# Altium project HenHouseController.PrjPCB
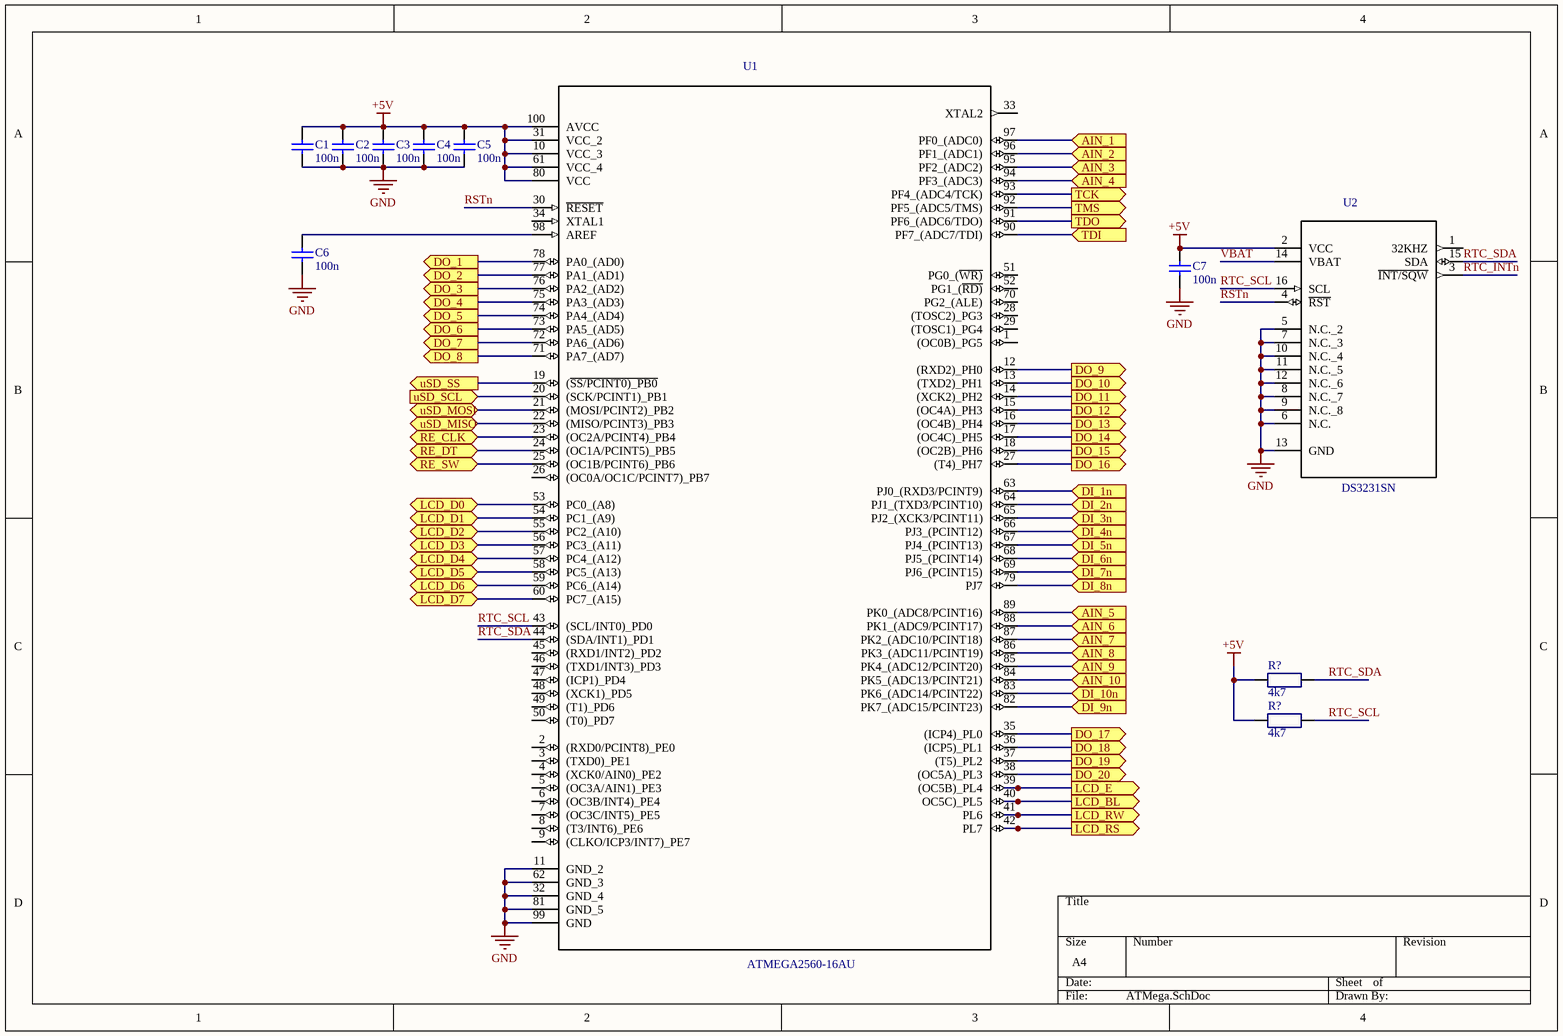
[diagram p0: ATMega.SchDoc]
3 sheets, 41 parts. Net scope: flat (ports and power ports of the same name join across sheets).
Board file: HenHouseController.PcbDoc
Sheets:
  HenHouseController.SchDoc
  ATMega.SchDoc
  InputOutput.SchDoc

## Sheet HenHouseController.SchDoc
size A4

## Sheet ATMega.SchDoc
size A4

### Parts
(Parts that share a designator on the sheet are numbered #1, #2 ... from top to bottom, then left to right.)
C1  value 100n  [CAP_0402]  (hidden comment: 0402)
C2  value 100n  [CAP_0402]  (hidden comment: 0402)
C3  value 100n  [CAP_0402]  (hidden comment: 0402)
C4  value 100n  [CAP_0402]  (hidden comment: 0402)
C5  value 100n  [CAP_0402]  (hidden comment: 0402)
C6  value 100n  [CAP_0402]  (hidden comment: 0402)
C7  value 100n  [CAP_0402]  (hidden comment: 0402)
R?#1  value 4k7  [RES_0402]  (hidden comment: RES_0402)
R?#2  value 4k7  [RES_0402]  (hidden comment: RES_0402)
U1  ATMEGA2560-16AU  [QFP50P1600X1600X120-100N]
U2  DS3231SN  [SOIC127P1032X265-16N]

### Ports
AIN_1 (in), AIN_2 (in), AIN_3 (in), AIN_4 (in), AIN_5 (in), AIN_6 (in), AIN_7 (in), AIN_8 (in), AIN_9 (in), AIN_10 (in), DI_1n (in), DI_2n (in), DI_3n (in), DI_4n (in), DI_5n (in), DI_6n (in), DI_7n (in), DI_8n (in), DI_9n (in), DI_10n (in), DO_1 (out), DO_2 (out), DO_3 (out), DO_4 (out), DO_5 (out), DO_6 (out), DO_7 (out), DO_8 (out), DO_9 (out), DO_10 (out), DO_11 (out), DO_12 (out), DO_13 (out), DO_14 (out), DO_15 (out), DO_16 (out), DO_17 (out), DO_18 (out), DO_19 (out), DO_20 (out), LCD_BL (out), LCD_D0 (bidir), LCD_D1 (bidir), LCD_D2 (bidir), LCD_D3 (bidir), LCD_D4 (bidir), LCD_D5 (bidir), LCD_D6 (bidir), LCD_D7 (bidir), LCD_E (out), LCD_RS (out), LCD_RW (out), RE_CLK (bidir), RE_DT (bidir), RE_SW (bidir), TCK (out), TDI (in), TDO (out), TMS (out), uSD_MISO (bidir), uSD_MOSI (bidir), uSD_SCL (in), uSD_SS (out)

### Nets
+5V: C1.2 C2.2 C3.2 C4.2 C5.2 C7.2 R?#1.1 R?#2.1 U1.10(VCC_3) U1.31(VCC_2) U1.61(VCC_4) U1.80(VCC) U1.100(AVCC) U2.2(VCC)
GND: C1.1 C2.1 C3.1 C4.1 C5.1 C6.1 C7.1 U1.11(GND_2) U1.32(GND_4) U1.62(GND_3) U1.81(GND_5) U1.99(GND) U2.5(N.C._2) U2.6(N.C.) U2.7(N.C._3) U2.8(N.C._7) U2.9(N.C._8) U2.10(N.C._4) U2.11(N.C._5) U2.12(N.C._6) U2.13(GND)
LCD_DB0: U1.53(PC0_(A8)) ; port LCD_D0
LCD_DB1: U1.54(PC1_(A9)) ; port LCD_D1
LCD_DB2: U1.55(PC2_(A10)) ; port LCD_D2
LCD_DB3: U1.56(PC3_(A11)) ; port LCD_D3
LCD_DB4: U1.57(PC4_(A12)) ; port LCD_D4
LCD_DB5: U1.58(PC5_(A13)) ; port LCD_D5
LCD_DB6: U1.59(PC6_(A14)) ; port LCD_D6
LCD_DB7: U1.60(PC7_(A15)) ; port LCD_D7
LCD_E: U1.39((OC5B)_PL4) ; port LCD_E
LCD_RS: U1.42(PL7) ; port LCD_RS
LCD_RW: U1.41(PL6) ; port LCD_RW
RSTn: U1.30(~{RESET}) U2.4(~{RST})
RTC_INTn: U2.3(~{INT/SQW})
RTC_SCL: R?#2.2 U1.43((SCL/INT0)_PD0) U2.16(SCL)
RTC_SDA: R?#1.2 U1.44((SDA/INT1)_PD1) U2.15(SDA)
VBAT: U2.14(VBAT)
NetC6_2: C6.2 U1.98(AREF)
NetOC1_10: U1.66(PJ3_(PCINT12)) ; port DI_4n
NetOC1_12: U1.65(PJ2_(XCK3/PCINT11)) ; port DI_3n
NetOC1_14: U1.64(PJ1_(TXD3/PCINT10)) ; port DI_2n
NetOC1_16: U1.63(PJ0_(RXD3/PCINT9)) ; port DI_1n
NetOC2_14: U1.83(PK6_(ADC14/PCINT22)) ; port DI_10n
NetOC2_16: U1.82(PK7_(ADC15/PCINT23)) ; port DI_9n
NetOC3_10: U1.79(PJ7) ; port DI_8n
NetOC3_12: U1.69(PJ6_(PCINT15)) ; port DI_7n
NetOC3_14: U1.68(PJ5_(PCINT14)) ; port DI_6n
NetOC3_16: U1.67(PJ4_(PCINT13)) ; port DI_5n
NetR?#4_2: U1.40(OC5C)_PL5) ; port LCD_BL
NetU1_12: U1.12((RXD2)_PH0) ; port DO_9
NetU1_13: U1.13((TXD2)_PH1) ; port DO_10
NetU1_14: U1.14((XCK2)_PH2) ; port DO_11
NetU1_15: U1.15((OC4A)_PH3) ; port DO_12
NetU1_16: U1.16((OC4B)_PH4) ; port DO_13
NetU1_17: U1.17((OC4C)_PH5) ; port DO_14
NetU1_18: U1.18((OC2B)_PH6) ; port DO_15
NetU1_19: U1.19((~{SS/PCINT0)_PB0}) ; port uSD_SS
NetU1_20: U1.20((SCK/PCINT1)_PB1) ; port uSD_SCL
NetU1_21: U1.21((MOSI/PCINT2)_PB2) ; port uSD_MOSI
NetU1_22: U1.22((MISO/PCINT3)_PB3) ; port uSD_MISO
NetU1_23: U1.23((OC2A/PCINT4)_PB4) ; port RE_CLK
NetU1_24: U1.24((OC1A/PCINT5)_PB5) ; port RE_DT
NetU1_25: U1.25((OC1B/PCINT6)_PB6) ; port RE_SW
NetU1_27: U1.27((T4)_PH7) ; port DO_16
NetU1_35: U1.35((ICP4)_PL0) ; port DO_17
NetU1_36: U1.36((ICP5)_PL1) ; port DO_18
NetU1_37: U1.37((T5)_PL2) ; port DO_19
NetU1_38: U1.38((OC5A)_PL3) ; port DO_20
NetU1_71: U1.71(PA7_(AD7)) ; port DO_8
NetU1_72: U1.72(PA6_(AD6)) ; port DO_7
NetU1_73: U1.73(PA5_(AD5)) ; port DO_6
NetU1_74: U1.74(PA4_(AD4)) ; port DO_5
NetU1_75: U1.75(PA3_(AD3)) ; port DO_4
NetU1_76: U1.76(PA2_(AD2)) ; port DO_3
NetU1_77: U1.77(PA1_(AD1)) ; port DO_2
NetU1_78: U1.78(PA0_(AD0)) ; port DO_1
NetU1_84: U1.84(PK5_(ADC13/PCINT21)) ; port AIN_10
NetU1_85: U1.85(PK4_(ADC12/PCINT20)) ; port AIN_9
NetU1_86: U1.86(PK3_(ADC11/PCINT19)) ; port AIN_8
NetU1_87: U1.87(PK2_(ADC10/PCINT18)) ; port AIN_7
NetU1_88: U1.88(PK1_(ADC9/PCINT17)) ; port AIN_6
NetU1_89: U1.89(PK0_(ADC8/PCINT16)) ; port AIN_5
NetU1_90: U1.90(PF7_(ADC7/TDI)) ; port TDI
NetU1_91: U1.91(PF6_(ADC6/TDO)) ; port TDO
NetU1_92: U1.92(PF5_(ADC5/TMS)) ; port TMS
NetU1_93: U1.93(PF4_(ADC4/TCK)) ; port TCK
NetU1_94: U1.94(PF3_(ADC3)) ; port AIN_4
NetU1_95: U1.95(PF2_(ADC2)) ; port AIN_3
NetU1_96: U1.96(PF1_(ADC1)) ; port AIN_2
NetU1_97: U1.97(PF0_(ADC0)) ; port AIN_1

Not connected (* = marked no-connect by the designer): U1 1((OC0B)_PG5) 2((RXD0/PCINT8)_PE0) 3((TXD0)_PE1) 4((XCK0/AIN0)_PE2) 5((OC3A/AIN1)_PE3) 6((OC3B/INT4)_PE4) 7((OC3C/INT5)_PE5) 8((T3/INT6)_PE6) 9((CLKO/ICP3/INT7)_PE7) 26((OC0A/OC1C/PCINT7)_PB7) 28((TOSC2)_PG3) 29((TOSC1)_PG4) 33(XTAL2) 34(XTAL1) 45((RXD1/INT2)_PD2) 46((TXD1/INT3)_PD3) 47((ICP1)_PD4) 48((XCK1)_PD5) 49((T1)_PD6) 50((T0)_PD7) 51(PG0_(~{WR)}) 52(PG1_(~{RD)}) 70(PG2_(ALE)); U2 1(32KHZ)

### Library data of the parts
C1-C7 = CAP_0402: Ceramic chip capacitor; SIGN: HL; Package: 0402; PartDescription: Chip capacitor; Component Class: A; Tolerance: ?
R?#1 R?#2 = RES_0402: SMD Chip Resistor 0402; SIGN: HL; PartDescription: Chip resistor; Package: 0402; Component Class: A; Operating Temperature: *; Tolerance: *
U1 = ATMEGA2560-16AU: Embedded microcontroller ATMEGA2560-16AU TQFP 100 _14x14_ Microchip Technology 8-Bit 16 MHz I/O number 86; SnapEDA_Link: https://www.snapeda.com/parts/ATMEGA2560-16AU/Microchip/view-part/?ref=snap; MF: Microchip; Price: None; Availability: Unavailable; MP: ATMEGA2560-16AU; Package: TQFP-100 Microchip; Value: *
U2 = DS3231SN: Real Time Clock Serial 16-Pin SOIC W; MF: Maxim Integrated; MP: DS3231SN#; Package: SOIC-16 Maxim Integrated; Price: None; SnapEDA_Link: https://www.snapeda.com/parts/DS3231SN%23/Maxim%20Integrated/view-part/?ref=snap; Availability: Unavailable; Value: *

## Sheet InputOutput.SchDoc
size A4
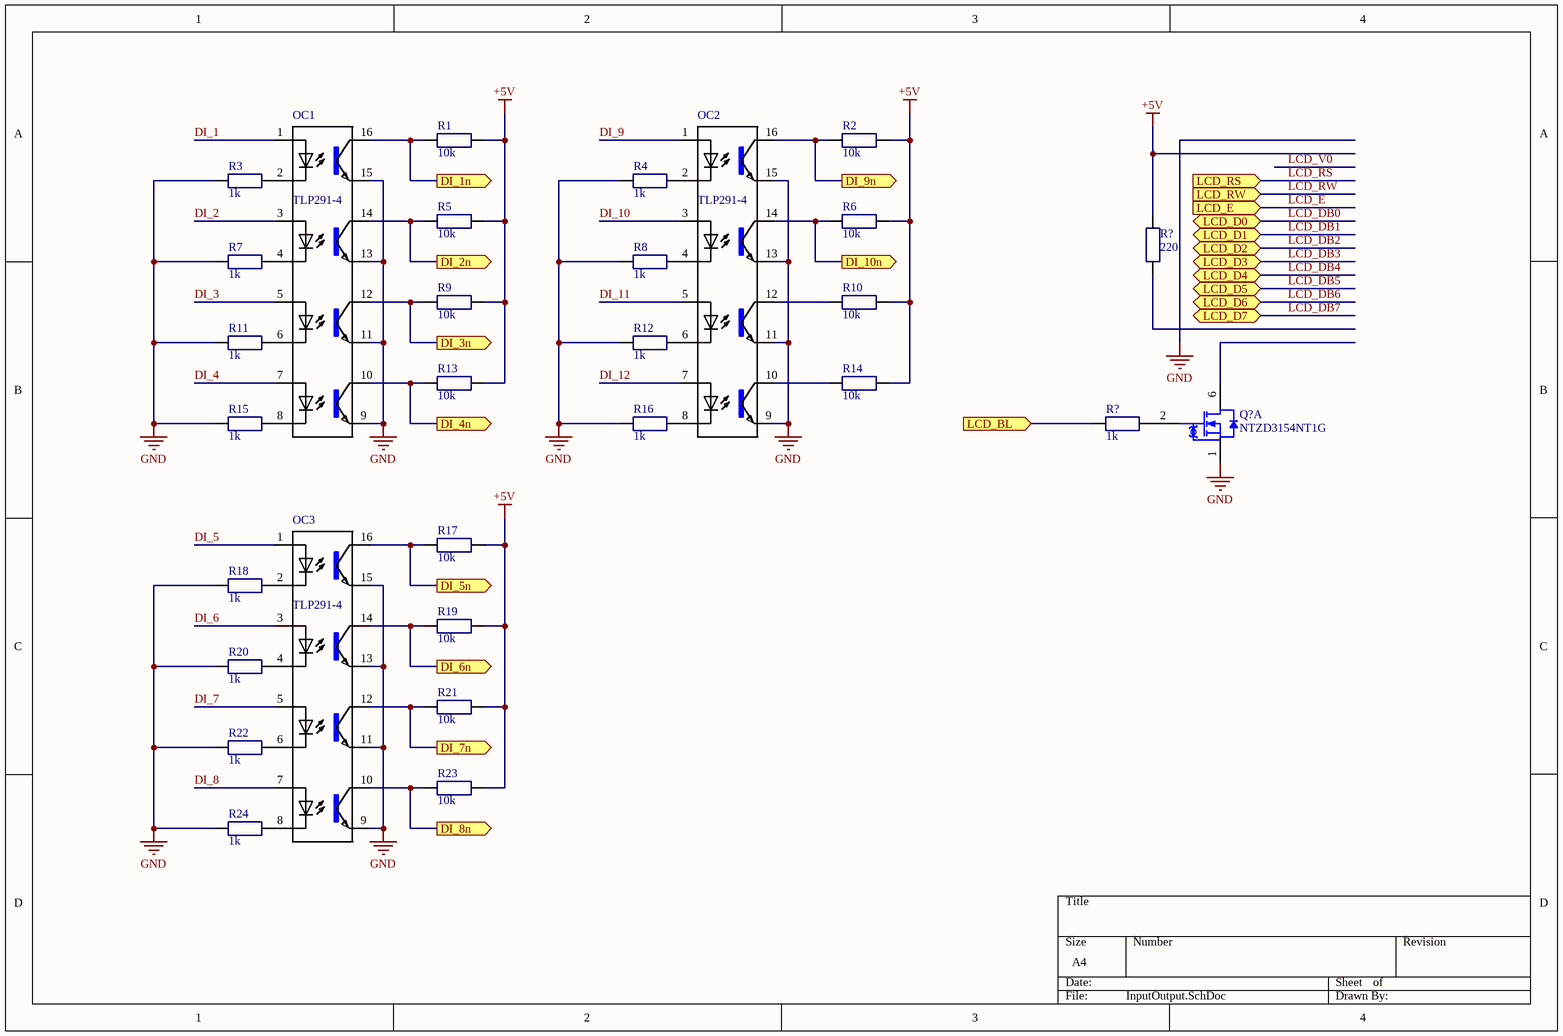
[diagram p1: InputOutput.SchDoc]

### Parts
(Parts that share a designator on the sheet are numbered #1, #2 ... from top to bottom, then left to right.)
OC1  TLP291-4
OC2  TLP291-4
OC3  TLP291-4
Q?  NTZD3154NT1G  [SOT-563-6-NTZD3154NT1G]  (part A of 2)
R1  value 10k  [RES_0402]  (hidden comment: RES_0402)
R2  value 10k  [RES_0402]  (hidden comment: RES_0402)
R3  value 1k  [RES_0402]  (hidden comment: RES_0402)
R4  value 1k  [RES_0402]  (hidden comment: RES_0402)
R5  value 10k  [RES_0402]  (hidden comment: RES_0402)
R6  value 10k  [RES_0402]  (hidden comment: RES_0402)
R7  value 1k  [RES_0402]  (hidden comment: RES_0402)
R8  value 1k  [RES_0402]  (hidden comment: RES_0402)
R9  value 10k  [RES_0402]  (hidden comment: RES_0402)
R10  value 10k  [RES_0402]  (hidden comment: RES_0402)
R11  value 1k  [RES_0402]  (hidden comment: RES_0402)
R12  value 1k  [RES_0402]  (hidden comment: RES_0402)
R13  value 10k  [RES_0402]  (hidden comment: RES_0402)
R14  value 10k  [RES_0402]  (hidden comment: RES_0402)
R15  value 1k  [RES_0402]  (hidden comment: RES_0402)
R16  value 1k  [RES_0402]  (hidden comment: RES_0402)
R17  value 10k  [RES_0402]  (hidden comment: RES_0402)
R18  value 1k  [RES_0402]  (hidden comment: RES_0402)
R19  value 10k  [RES_0402]  (hidden comment: RES_0402)
R20  value 1k  [RES_0402]  (hidden comment: RES_0402)
R21  value 10k  [RES_0402]  (hidden comment: RES_0402)
R22  value 1k  [RES_0402]  (hidden comment: RES_0402)
R23  value 10k  [RES_0402]  (hidden comment: RES_0402)
R24  value 1k  [RES_0402]  (hidden comment: RES_0402)
R?#3  value 220  [RES_0402]  (hidden comment: RES_0402)
R?#4  value 1k  [RES_0402]  (hidden comment: RES_0402)

### Ports
DI_1n (out), DI_2n (out), DI_3n (out), DI_4n (out), DI_5n (out), DI_6n (out), DI_7n (out), DI_8n (out), DI_9n (out), DI_10n (out), LCD_BL (in), LCD_D0 (bidir), LCD_D1 (bidir), LCD_D2 (bidir), LCD_D3 (bidir), LCD_D4 (bidir), LCD_D5 (bidir), LCD_D6 (bidir), LCD_D7 (bidir), LCD_E (in), LCD_RS (in), LCD_RW (in)

### Nets
+5V: R1.2 R2.2 R5.2 R6.2 R9.2 R10.2 R13.2 R14.2 R17.2 R19.2 R21.2 R23.2 R?#3.2
GND: OC1.9(EMI) OC1.11(EMI) OC1.13(EMI) OC1.15(EMI) OC2.9(EMI) OC2.11(EMI) OC2.13(EMI) OC2.15(EMI) OC3.9(EMI) OC3.11(EMI) OC3.13(EMI) OC3.15(EMI) Q?.1(S1) R3.1 R4.1 R7.1 R8.1 R11.1 R12.1 R15.1 R16.1 R18.1 R20.1 R22.1 R24.1
DI_1: OC1.1(A)
DI_2: OC1.3(A)
DI_3: OC1.5(A)
DI_4: OC1.7(A)
DI_5: OC3.1(A)
DI_6: OC3.3(A)
DI_7: OC3.5(A)
DI_8: OC3.7(A)
DI_9: OC2.1(A)
DI_10: OC2.3(A)
DI_11: OC2.5(A)
DI_12: OC2.7(A)
NetOC1_2: OC1.2(C) R3.2
NetOC1_4: OC1.4(C) R7.2
NetOC1_6: OC1.6(C) R11.2
NetOC1_8: OC1.8(C) R15.2
NetOC1_10: OC1.10(COL) R13.1 ; port DI_4n
NetOC1_12: OC1.12(COL) R9.1 ; port DI_3n
NetOC1_14: OC1.14(COL) R5.1 ; port DI_2n
NetOC1_16: OC1.16(COL) R1.1 ; port DI_1n
NetOC2_2: OC2.2(C) R4.2
NetOC2_4: OC2.4(C) R8.2
NetOC2_6: OC2.6(C) R12.2
NetOC2_8: OC2.8(C) R16.2
NetOC2_10: OC2.10(COL) R14.1
NetOC2_12: OC2.12(COL) R10.1
NetOC2_14: OC2.14(COL) R6.1 ; port DI_10n
NetOC2_16: OC2.16(COL) R2.1 ; port DI_9n
NetOC3_2: OC3.2(C) R18.2
NetOC3_4: OC3.4(C) R20.2
NetOC3_6: OC3.6(C) R22.2
NetOC3_8: OC3.8(C) R24.2
NetOC3_10: OC3.10(COL) R23.1 ; port DI_8n
NetOC3_12: OC3.12(COL) R21.1 ; port DI_7n
NetOC3_14: OC3.14(COL) R19.1 ; port DI_6n
NetOC3_16: OC3.16(COL) R17.1 ; port DI_5n
NetQ?_2: Q?.2(G1) R?#4.1
NetR?#4_2: R?#4.2 ; port LCD_BL

Not connected (* = marked no-connect by the designer): Q? 6(D1); R?#3 1

### Library data of the parts
OC1-OC3 = TLP291-4: Optocoupler, Phototrans, 2.5kv, S0-16 package; MF: Toshiba; MP: TLP293; Package: SOIC-4 Toshiba; Price: None; SnapEDA_Link: https://www.snapeda.com/parts/TLP293/Toshiba/view-part/?ref=snap; Availability: Unavailable; Value: *
Q? = NTZD3154NT1G: Small Signal MOSFET, 20 V, 540 mA, Dual N-Channel, 6-Pin SOT-563, Pb-Free; Manufacturer: On Semiconductor; Channel Polarity: N Channel; Ciss Typ (pF): 80; Coss Typ (pF): 13; Crss Typ (pF): 10; ID Max (A): 0.54; Packing: Tape and Reel; V(BR)DSS Min (V): 20; VGS Max (V): 6; VGS(th) Max (V): 1; DatasheetVersion: Rev. 2; PackageVersion: Rev. F, 04/2005; PackageReference: SOT-563-6-463A-01; PackageDescription: 6-Pin Small Outline Transistor, Body 1.6 x 1.2 mm, Pitch 0.5 mm; Configuration: Dual; Package Type: SOT-563; RoHS: Pb-Free; Mounting Technology: Surface Mount; PartNumber: NTZD3154NT1G; ComponentLink2Description: Datasheet; ComponentLink2URL: http://www.onsemi.com/pub_link/Collateral/NTZD3154N-D.PDF; Supplier 1: *; Supplier Part Number 1: *
R1-R24 R?#3 R?#4 = RES_0402: SMD Chip Resistor 0402; SIGN: HL; PartDescription: Chip resistor; Package: 0402; Component Class: A; Operating Temperature: *; Tolerance: *

## Nets that join several sheets
+5V: ATMega (14 pins), InputOutput (13 pins)
GND: ATMega (21 pins), InputOutput (25 pins)
NetOC1_10: ATMega (U1.66), InputOutput (OC1.10 R13.1)
NetOC1_12: ATMega (U1.65), InputOutput (OC1.12 R9.1)
NetOC1_14: ATMega (U1.64), InputOutput (OC1.14 R5.1)
NetOC1_16: ATMega (U1.63), InputOutput (OC1.16 R1.1)
NetOC2_14: ATMega (U1.83), InputOutput (OC2.14 R6.1)
NetOC2_16: ATMega (U1.82), InputOutput (OC2.16 R2.1)
NetOC3_10: ATMega (U1.79), InputOutput (OC3.10 R23.1)
NetOC3_12: ATMega (U1.69), InputOutput (OC3.12 R21.1)
NetOC3_14: ATMega (U1.68), InputOutput (OC3.14 R19.1)
NetOC3_16: ATMega (U1.67), InputOutput (OC3.16 R17.1)
NetR?#4_2: ATMega (U1.40), InputOutput (R?#4.2)